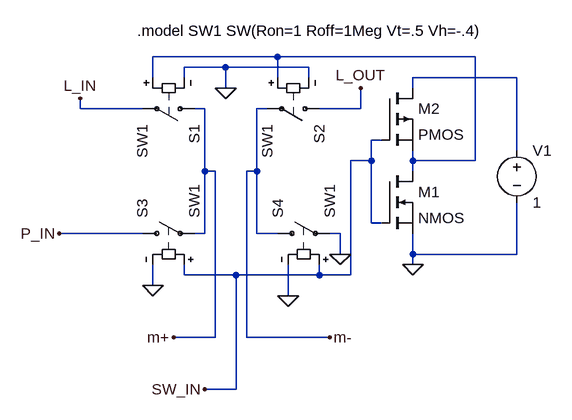
[diagram p0: schematic Switchboxsymbol.asc]
Switchboxsymbol.asc, the LTspice schematic file:
Version 4
SHEET 1 880 680
WIRE 160 0 -32 0
WIRE 464 0 160 0
WIRE 80 16 16 16
WIRE 208 16 80 16
WIRE -32 32 -32 0
WIRE 16 32 16 16
WIRE 160 32 160 0
WIRE 208 32 208 16
WIRE 528 32 368 32
WIRE 80 48 80 16
WIRE 368 48 368 32
WIRE -144 80 -144 64
WIRE -48 80 -144 80
WIRE 48 80 32 80
WIRE 144 80 128 80
WIRE 288 80 288 48
WIRE 288 80 224 80
WIRE 320 128 304 128
WIRE 528 144 528 32
WIRE 304 160 304 128
WIRE 304 160 272 160
WIRE 368 160 368 144
WIRE 464 160 464 0
WIRE 464 160 368 160
WIRE 48 176 48 80
WIRE 64 176 48 176
WIRE 128 176 128 80
WIRE 128 176 112 176
WIRE 368 176 368 160
WIRE 304 256 304 160
WIRE 320 256 304 256
WIRE -48 272 -176 272
WIRE 48 272 48 176
WIRE 48 272 32 272
WIRE 128 272 128 176
WIRE 160 272 128 272
WIRE 256 272 240 272
WIRE 256 304 256 272
WIRE 368 304 368 272
WIRE 528 304 528 224
WIRE 528 304 368 304
WIRE 368 320 368 304
WIRE 16 336 16 320
WIRE 96 336 16 336
WIRE 224 336 224 320
WIRE 224 336 96 336
WIRE 272 336 272 160
WIRE 272 336 224 336
WIRE -32 352 -32 320
WIRE 176 368 176 320
WIRE 64 432 64 176
WIRE 64 432 0 432
WIRE 112 432 112 176
WIRE 240 432 112 432
WIRE 96 512 96 336
WIRE 96 512 48 512
FLAG 368 320 0
FLAG -32 352 0
FLAG 176 368 0
FLAG 80 48 0
FLAG -144 64 L_IN
FLAG 288 48 L_OUT
FLAG -176 272 P_IN
FLAG 0 432 m+
FLAG 240 432 m-
FLAG 256 304 0
FLAG 48 512 SW_IN
SYMBOL voltage 528 128 R0
WINDOW 123 0 0 Left 2
WINDOW 39 0 0 Left 2
SYMATTR InstName V1
SYMATTR Value 1
SYMBOL nmos 320 176 R0
SYMATTR InstName M1
SYMBOL pmos 320 48 R0
SYMATTR InstName M2
SYMBOL sw 48 80 R90
SYMATTR InstName S1
SYMATTR Value SW1
SYMBOL sw 240 80 R90
SYMATTR InstName S2
SYMATTR Value SW1
SYMBOL sw -64 272 R270
SYMATTR InstName S3
SYMATTR Value SW1
SYMBOL sw 144 272 R270
SYMATTR InstName S4
SYMATTR Value SW1
TEXT -56 -40 Left 2 !.model SW1 SW(Ron=1 Roff=1Meg Vt=.5 Vh=-.4)

The netlist it stands for:
* Switchboxsymbol.asc
V1 N002 0 1
M1 N001 SW_IN 0 0 NMOS
M2 N002 SW_IN N001 N001 PMOS
S1 m+ L_IN N001 0 SW1
S2 L_OUT m- N001 0 SW1
S3 P_IN m+ SW_IN 0 SW1
S4 m- 0 SW_IN 0 SW1
.model NMOS NMOS
.model PMOS PMOS
.lib standard.mos
.model SW1 SW(Ron=1 Roff=1Meg Vt=.5 Vh=-.4)
.backanno
.end